# Altium schematic sheet MM_2.0_power_sch.SchDoc
size Letter; DrawnBy: Thevinu Fernando; SheetNumber: 1; SheetTotal: 1
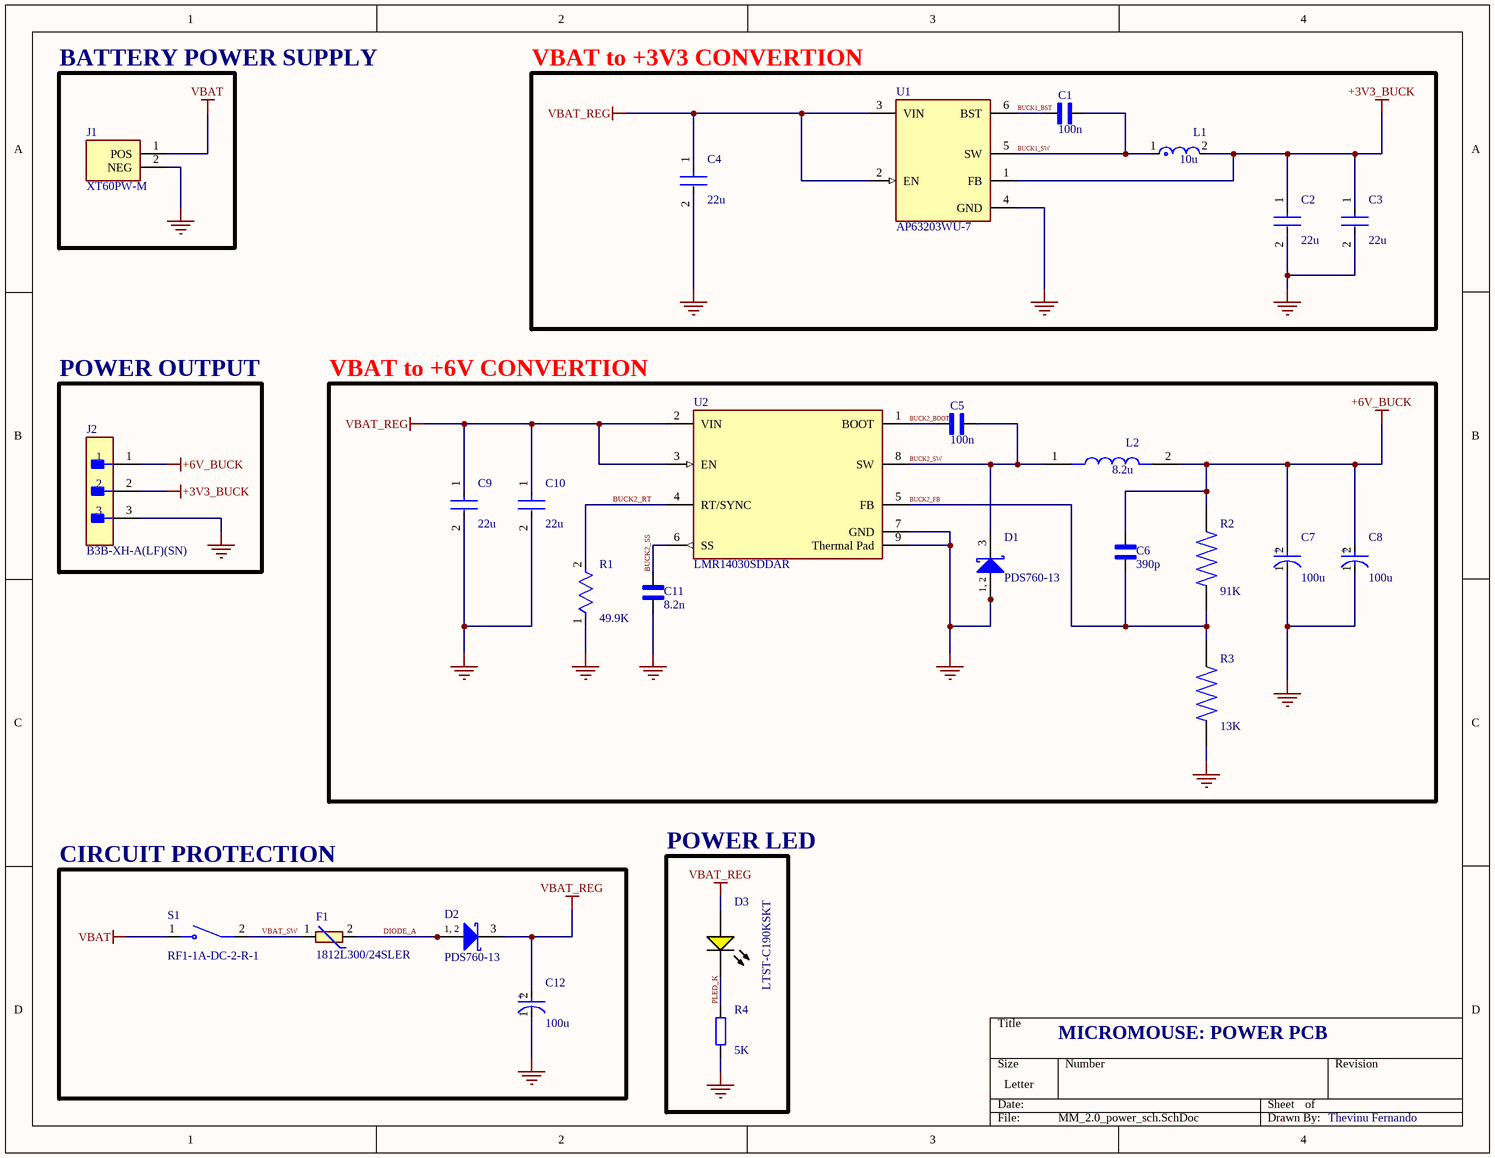
[diagram p0: MM_2.0_power_sch.SchDoc]

## Parts
C1  100n  [CAP_0402]
C2  22u  [CAPC320160X160_CL31H-0_2_N]
C3  22u  [CAPC320160X160_CL31H-0_2_N]
C4  22u  [CAPC320160X160_CL31H-0_2_N]
C5  100n  [CAP_0402]
C6  390p  [CAP_0402]
C7  100u  [FP-OS-CON-SMT-C6-MFG]
C8  100u  [FP-OS-CON-SMT-C6-MFG]
C9  22u  [CAPC320160X160_CL31H-0_2_N]
C10  22u  [CAPC320160X160_CL31H-0_2_N]
C11  8.2n  [CAP_0402]
C12  100u  [FP-OS-CON-SMT-C6-MFG]
D1  PDS760-13  [DIOD-POWERDI5-3_V]
D2  PDS760-13  [DIOD-POWERDI5-3_V]
D3  LTST-C190KSKT  [LTST-C190KSKT_V]
F1  1812L300/24SLER  [FUSSC324X455X250-2N]
J1  XT60PW-M  [AMASS_XT60PW-M]
J2  B3B-XH-A(LF)(SN)  [FP-B3B-XH-A_LF_SN-MFG]
L1  10u  [FP-VLS6045EX-100M-MFG]
L2  8.2u  [IND_104CDMCCDS-8R2MC]
R1  49.9K  [FP-ERA6A_N]
R2  91K  [RESC1608X55N]
R3  13K  [RESC1608X55N]
R4  5K  [RES_0805]
S1  RF1-1A-DC-2-R-1  [SW_RF1-1A-DC-2-R-1]
U1  AP63203WU-7  [FP-TSOT26-IPC_B]
U2  LMR14030SDDAR  [FP-DDA0008E-MFG]

## Blocks framed on the sheet
BATTERY POWER SUPPLY: J1
VBAT to +3V3 CONVERTION: C1-C4 L1 U1
POWER OUTPUT: J2
VBAT to +6V CONVERTION: C5-C11 D1 L2 R1-R3 U2
POWER LED: D3 R4
CIRCUIT PROTECTION: C12 D2 F1 S1

## Nets
+3V3_BUCK: C2.1 C3.1 J2.2 L1.2 U1.1(FB)
+6V_BUCK: C6.1 C7.2(A) C8.2(A) J2.1 L2.2 R2.2
GND: C2.2 C3.2 C4.2 C7.1(C) C8.1(C) C9.2 C10.2 C11.2 C12.1(C) D1.1(A) D1.2(A) J1.2(NEG) J2.3 R1.1 R3.1 R4.1 U1.4(GND) U2.7(GND) U2.9(Thermal_Pad)
VBAT: J1.1(POS) S1.1
VBAT_REG: C4.1 C9.1 C10.1 C12.2(A) D2.3(K) D3.1(A) U1.2(EN) U1.3(VIN) U2.2(VIN) U2.3(EN)
BUCK1_BST: C1.2 U1.6(BST)
BUCK1_SW: C1.1 L1.1 U1.5(SW)
BUCK2_BOOT: C5.2 U2.1(BOOT)
BUCK2_FB: C6.2 R2.1 R3.2 U2.5(FB)
BUCK2_RT: R1.2 U2.4(RT/SYNC)
BUCK2_SS: C11.1 U2.6(SS)
BUCK2_SW: C5.1 D1.3(K) L2.1 U2.8(SW)
DIODE_A: D2.1(A) D2.2(A) F1.2
PLED_K: D3.2(K) R4.2
VBAT_SW: F1.1 S1.2

## Notes on the sheet
- MICROMOUSE: POWER PCB
- Thevinu Fernando
- (in symbol CMP-2000-07476-1) 1, 2
- (in symbol CMP-05428-000037-2) +

## Library data of the parts
C1 C5 C6 C11 = CL05B104KO5NNNC: 0.1 ÂµF Â±10% 16V Ceramic Capacitor X7R 0402 (1005 Metric); MF: Samsung; SnapEDA_Link: https://www.snapeda.com/parts/CL05B104KO5NNNC/Samsung/view-part/?ref=snap; Package: SMD-2-2 Samsung; Value: *; MP: CL05B104KO5NNNC; Check_prices: https://www.snapeda.com/parts/CL05B104KO5NNNC/Samsung/view-part/?ref=eda
C2-C4 C9 C10 = CMP-13271-000012-2: Ceramic Capacitor, Multilayer, Ceramic, 25V, 10% +Tol, 10% -Tol, X5R, 15% TC, 22uF, Surface Mount, 1206; Part Number: CL31A226KAHNNNE; Manufacturer: Samsung; Symbol Hash: fb88589c83559698c54462c48d907c3ddae810bd717f4f20b193cecb944ab7ab; Verification Version: 0.0.0.3; Capacitance: 22µF; Mouser Part Number: 187-CL31A226KAHNNNE; Temperature Coefficient: 15%; Temperature Range High: +85°C; Digikey Description: CAP CER 22UF 25V X5R 1206; Digikey Part Number: 1276-3047-1-ND; Tolerance: 10%; ComponentLink2URL: https://product.samsungsem.com/mlcc/CL31A226KAHNNN.do; ComponentLink2Description: Datasheet; Voltage Rating: 25V; Lead Free: Yes; Height: 1.8mm; Temperature Characteristic: X5R; Automotive: No; Package: CL31H-0.2; Temperature Range Low: -55°C; Capacitance: 22uF; RoHS: TRUE; Material: Ceramic; Ipc Land Pattern Name: CAPC320160X160; ComponentLink1Description: Upverter; Supplier 2: Mouser; Supplier 1: Digi-Key; ComponentLink1URL: https://upverter.com/part/id/4e7a76ad8fe2f2e1/; Supplier Part Number 2: 187-CL31A226KAHNNNE; Supplier Part Number 1: 1276-3047-1-ND; Value: 22uF; helpURL: https://upverter.com/part/id/4e7a76ad8fe2f2e1/; Temperature: -55°C to +85°C; RoHS: Compliant; Dielectric: X5R; HelpURL: https://product.samsungsem.com/mlcc/CL31A226KAHNNN.do; Max Operating Temperature: 85°C; Voltage Rating (DC): 25V; ComponentLink2Description: Datasheet URL; Min Operating Temperature: -55°C; Case/Package: 1206
C7 C8 C12 = CMP-05428-000037-2: Conductive Polymer Aluminum Solid Capacitors (OS-CON) 100uF ±20% 16V; Ripple Current: 2.49A; Leakage Current: 300uA; Life (Hours): 2000Hour; ESR (Equivalent Series Resistance): 24mR; Polarity: Polar; Dissipation Factor: 12%; Voltage Rating: 16V; Max Operating Temperature: 105°C; Number of Pins: 6; Case/Package: Radial; Length: 5.9mm; Termination: SMD/SMT; Voltage: 16V; Ripple Current (AC): 2.49A; Diameter: 6.3mm; Capacitance: 100uF; Min Operating Temperature: -55°C; Package Quantity: 1000; Series: OS-CON™, SVPC; Lead Free: Lead Free; Packaging: Tape and Reel; Height - Seated (Max): 0.236inch; REACH SVHC: No SVHC; Radiation Hardening: No; Tolerance: 20%; Mount: Surface Mount; Height: 5.9mm; RoHS Compliant: Yes; Construction: Cylindrical; Voltage Rating (DC): 16V
D1 D2 = CMP-2000-07476-1: Schottky Barrier Rectifier, 60 V, 7 A, -65 to 150 degC, 3-Pin SMD, RoHS, Tape and Reel; Manufacturer: Diodes Inc; Max Repetitive Reverse Voltage (Vrrm): 60V; Element Configuration: CommonAnode; Max Forward Surge Current (Ifsm): 275A; Polarity: Standard; Forward Voltage: 620mV; Forward Current: 7A; Peak Reverse Current: 200uA; Case\/Package: SMD/SMT; Manufacturer URL: http://www.diodes.com/; Reverse Voltage (DC): 60V; Lead Free: LeadFree; Voltage Rating (DC): 60V; Min Operating Temperature: -65degC; Package Description: 3-Pin Surface Mount Device, Body 3.975 x 5.375 mm, Pitch 1.84 mm; Length: 4.05mm; Datasheet URL: https://www.diodes.com/assets/Datasheets/ds30477.pdf; REACH SVHC: NoSVHC; Peak Non-Repetitive Surge Current: 275A; Output Current: 7A; Contact Plating: Matte; Mounting Technology: SurfaceMount; Mount: SurfaceMount; RoHSCompliant: true; Weight: 0.003386oz; Current Rating: 7A; Max Operating Temperature: 150degC; Package Quantity: 5000; Height: 1.15mm; Average Rectified Current: 7A; Datasheet Version: Rev. 13-2, 10/2012; Number of Pins: 5; Width: 5.45mm; Packaging: TapeandReel; Radiation Hardening: No; Package Reference: POWERDI5-3
D3 = CMP-1674-00009-1: LED Uni-Color Yellow, 75 mW, 30 mA, -30 to 85 degC, 2-Pin SMD, RoHS, Tape and Reel; Voltage Rating: 50 V; Case\Package: 0603; Power Rating: 100 mW; Tolerance: 1%; Resistance: 12 kohm; Packaging: Tape and Reel; RoHSCompliant: true; Height: 0.45 mm; Max Operating Temperature: 155 degC; Mount: Surface Mount; DatasheetVersion: Rev. I, 10/2012; Min Operating Temperature: -55 degC; PackageReference: C190KSKT; ComponentLink1Description: Manufacturer URL; Length: 1.6 mm; REACH SVHC: No SVHC; Case Code (Imperial): 0603; Voltage Rating (DC): 50 V; PackageDescription: 2-Pin Surface Mount Device, Body 1.6 x 0.8 mm; Case Code (Metric): 1608; Package Quantity: 5000; ComponentLink2Description: Datasheet; Width: 0.8 mm; Pins: 2; ComponentLink2URL: http://optoelectronics.liteon.com/upload/download/DS-22-99-0189/S_110_LTST-C190KSKT.pdf; ComponentLink1URL: http://www.us.liteon.com/
F1 = 1812L300/24SLER: Polymeric PTC Resettable Fuse 24V 3 A Ih Surface Mount 1812 (4532 Metric), Concave; MF: Littelfuse Inc.; Check_prices: https://www.snapeda.com/parts/1812L300/24SLER/Littelfuse/view-part/?ref=eda; Availability: In Stock; Price: None; Package: None; Value: *; SnapEDA_Link: https://www.snapeda.com/parts/1812L300/24SLER/Littelfuse/view-part/?ref=snap; Purchase-URL: https://pricing.snapeda.com/search/part/1812L300/24SLER/?ref=eda; MP: 1812L300/24SLER
J1 = XT60PW-M: Socket, DC supply, male, PIN: 2; MF: AMASS; Check_prices: https://www.snapeda.com/parts/XT60PW-M/AMASS/view-part/?ref=eda; SnapEDA_Link: https://www.snapeda.com/parts/XT60PW-M/AMASS/view-part/?ref=snap; Price: None; Availability: Not in stock; Package: Package; MP: XT60PW-M; Value: *
J2 = CMP-17439-000014-3: CONN HEADER VERT 3POS 2.5MM; Max Voltage Rating (DC): 250V; Number of Positions: 3; Current Rating: 3A; Gender: Male; Wire/Cable Gauge: 22AWG; Contact Resistance: 20mR; Insulation Resistance: 1GR; Insulation Material: Nylon; Contact Plating: Tin; Depth: 5.75mm; Contact Type: Male Pin; Max Operating Temperature: 85°C; Insulation Color: Natural; Voltage Rating (AC): 250V; Color: Natural; Connector Type: Header; Orientation: Straight; Fastening Type: Detent; Housing Color: White; Min Operating Temperature: -25°C; Termination: Solder; Voltage Rating: 250V; Series: XH; Pitch: 2.5mm; Contact Shape: Square; Number of Rows: 1; Lead Free: Lead Free; Packaging: Bulk; Mount: Through Hole; Flammability Rating: UL94 V-0; Max Voltage Rating (AC): 250V; REACH SVHC: No SVHC; Housing Material: Polyamide; Contact Material: Brass; Lead Pitch: 2.5mm; Contact Finish - Mating: TIN; Length: 9.9mm; Max Current Rating: 3A; Number of Contacts: 3
L1 = CMP-08253-000184-1: FIXED IND 10UH 3.4A 61 MOHM SMD; Saturation Current: 3.9A; Shielding: Shielded; Test Frequency: 100kHz; Core Material: Ferrite; Inductance Tolerance: 20%; DC Resistance (DCR): 61mR; Current Rating: 3.4A; REACH SVHC: No SVHC; Min Operating Temperature: -40°C; RoHS Compliant: Yes; Length: 0.236inch; Lead Free: Lead Free; Packaging: Cut Tape; RMS Current (Irms): 3.4A; Width: 0.236inch; Case/Package: Nonstandard; Resistor Type: Wirewound; Inductance: 10uH; Height - Seated (Max): 0.177inch; Mount: Surface Mount; Max Operating Temperature: 105°C; Tolerance: 20%
L2 = 104CDMCCDS-8R2MC: Inductor Power Shielded/Molded Wirewound 8.2uH 20% 100KHz Metal 8.3A 0.027Ohm DCR 4040 T/R; MF: Sumida; Package: Nonstandard Sumida; Check_prices: https://www.snapeda.com/parts/104CDMCCDS-8R2MC/Sumida/view-part/?ref=eda; Value: *; Price: None; Purchase-URL: https://pricing.snapeda.com/search/part/104CDMCCDS-8R2MC/?ref=eda; MP: 104CDMCCDS-8R2MC; SnapEDA_Link: https://www.snapeda.com/parts/104CDMCCDS-8R2MC/Sumida/view-part/?ref=snap; Availability: In Stock
R1 = CMP-2001-00839-2: Res Thin Film 0805 49.9K Ohm 0.1% 0.125W(1/8W) +/-25ppm/ßC SMD Automotive T/R; Power Rating: 125mW; Resistance: 49.9kΩ; Temperature Coefficient: 25ppm/°C; Voltage Rating (DC): 100V; Weight: 5.499807mg; Lead Free: Lead Free; Max Operating Temperature: 155°C; Number of Terminations: 2; Case Code (Metric): 2012; Case/Package: 0805; Lifecycle Status: Production; Case Code (Imperial): 0805; Composition: Metal Film, Thin Film; RoHS: Compliant; Features: Automotive AEC-Q200; Radiation Hardening: No; Termination: SMD/SMT; Depth: 1.25mm; Mount: Surface Mount; Number of Pins: 2; Contact Plating: Tin; Min Operating Temperature: -55°C; REACH SVHC: Unknown; Tolerance: 0.1%; Length: 2mm; Height: 500µm; Schedule B: 8533210045, 8533210045|8533210045|8533210045|8533210045|8533210045|8533210045|8533210045|8533210045|8533210045|8533210045|8533210045|8533210045|8533210045|8533210045|8533210045|8533210045, 8533210045|8533210045|8533210045|8533210045|8533210045|8533210045|8533210045|8533210045|8533210045|8533210045|8533210045|8533210045|8533210045|8533210045|8533210045|8533210045|8533210045, 8533210045|8533210045|8533210045|8533210045|8533210045|8533210045|8533210045|8533210045|8533210045|8533210045|8533210045|8533210045|8533210045|8533210045|8533210045|8533210045|8533210045|8533210045; Military Standard: Not; Max Power Dissipation: 125mW; Packaging: Cut Tape; Voltage Rating: 100V
R2 R3 = RC0603FR-0791KL: 91 kOhms Â±1% 0.1W, 1/10W Chip Resistor 0603 (1608 Metric) Moisture Resistant Thick Film; MF: Yageo; SnapEDA_Link: https://www.snapeda.com/parts/RC0603FR-0791KL/Yageo/view-part/?ref=snap; Package: 1608 Yageo; Value: *; MP: RC0603FR-0791KL; Check_prices: https://www.snapeda.com/parts/RC0603FR-0791KL/Yageo/view-part/?ref=eda
R4 = RES_0805: Resistor SMD 0805; Manufacturer: *; Manufacturer Part Number: *; Distributor Link: *; LCSC: *
S1 = RF1-1A-DC-2-R-1: Switch, Mini Rocker, 2P SPST OFF-ON, Red w/ Print, VDC | Switch Components RF1-1A-DC-2-R-1; SnapEDA_Link: https://www.snapeda.com/parts/RF1-1A-DC-2-R-1/Switch+Components/view-part/?ref=snap; Package: None; Value: *; MF: Switch Components; MP: RF1-1A-DC-2-R-1; Check_prices: https://www.snapeda.com/parts/RF1-1A-DC-2-R-1/Switch+Components/view-part/?ref=eda
U1 = CMP-12757-000006-1: IC REG BUCK 3.3V 2A TSOT26; Manufacturer: Diodes Inc.; Output Type: Fixed; Min Supply Voltage: 3.8V; Number Of Outputs: 1; Max Junction Temp: +160°C; Nominal Supply Current: 22uA; Standoff Height: 0.01mm; Switching Frequency: 1.1MHz; Max Supply Voltage: 32V; ComponentLink2Description: Datasheet; Device Class L1: Integrated Circuits (ICs); Temperature: to +160°C; Device Class L3: Voltage Regulators - Switching; RoHS: TRUE; Octopart: https://octopart.com/ap63203wu-7-diodes+inc.-98099550; Output Voltage: 3.3V; Lead Free: Yes; ComponentLink2URL: https://www.diodes.com/assets/Datasheets/AP63200-AP63201-AP63203-AP63205.pdf; Digikey Description: IC REG BUCK 3.3V 2A TSOT26; Footprint Url: https://www.diodes.com/assets/Package-Files/TSOT26.pdf; Ambient Temperature Range High: +85°C; Height: 1mm; Automotive: No; Temperature Range High: +160°C; Switching Topology: Buck; Output Current: 2A; Package: TSOT26; Category: IC; Mouser Description: AP63203 Series 3.3 V 2 A SMT Fixed Low IQ Synchronous Buck - TSOT-26; Device Class L2: Power Management ICs; Ambient Temperature Range Low: -40°C; Manufacturer Part Number: AP63203WU-7
U2 = CMP-04918-000074-1: IC REG BUCK ADJ 3.5A 8SOPWR; Manufacturer: Texas Instruments; Output Voltage: 0.8-28V; Switching Frequency: 200-2500kHz; Max Duty Cycle: 97%; Max Junction Temp: +125°C; Number Of Outputs: 1; Max Supply Voltage: 40V; Nominal Supply Current: 40uA; Min Supply Voltage: 4V; Output Type: AdjustableProgrammable; Standoff Height: 0mm; Ipc Land Pattern Name: SOIC127P600X170-8; ComponentLink2Description: Datasheet; Digikey Description: IC REG BUCK ADJ 3.5A 8SOPWR; Device Class L1: Integrated Circuits (ICs); ComponentLink2URL: http://www.ti.com/lit/ds/symlink/lmr14030.pdf; Temperature Range High: +125°C; Temperature: -40°C to +125°C; Output Current: 3.5A; Octopart: https://octopart.com/lmr14030sddar-texas+instruments-55347267; Device Class L3: Voltage Regulators - Switching; Lead Free: Yes; Mouser Description: 40V, 3.5A SIMPLE SWITCHER, 2.2MHz Step-Down Regulator with 40uA IQ 8-SO PowerPAD -40 to 125; Temperature Range Low: -40°C; Automotive: No; Switching Topology: Buck; Category: IC; RoHS: TRUE; Manufacturer Part Number: LMR14030SDDAR; Height: 1.7mm; Device Class L2: Power Management ICs; Package: DDA0008E